# Altium project TFG.PrjPCB
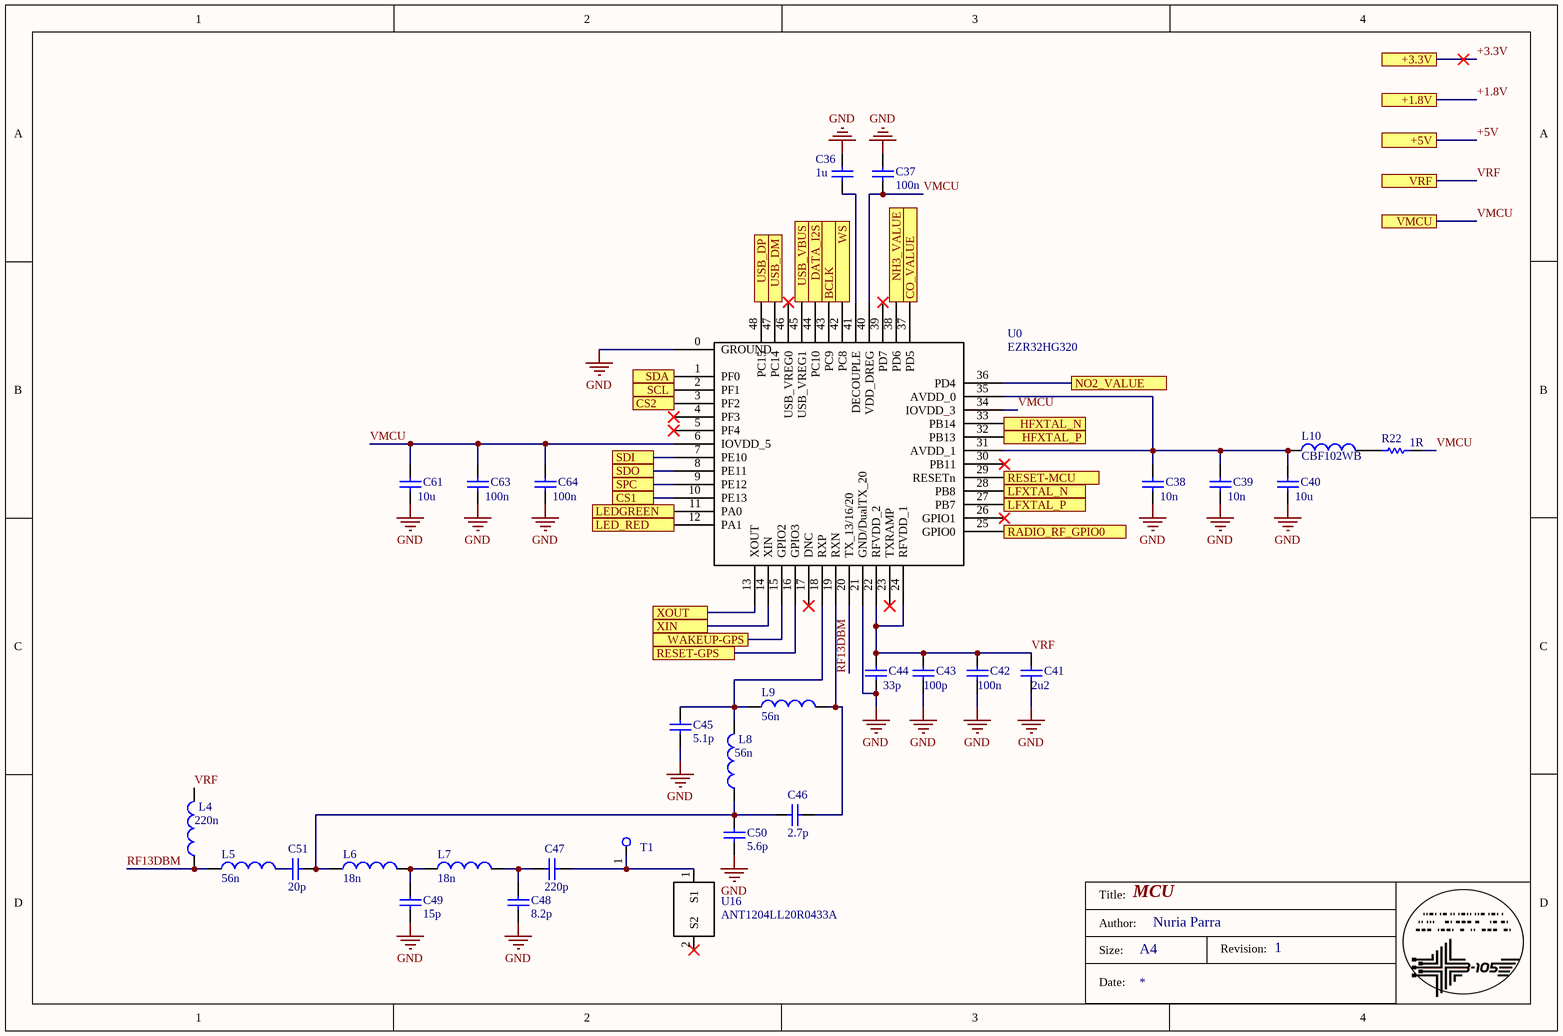
[diagram p0: MCU.SchDoc]
5 sheets, 122 parts. Net scope: flat (ports and power ports of the same name join across sheets).
Board file: PrimeraEntrega.PcbDoc
Sheets:
  MCU.SchDoc
  Reguladores.SchDoc
  VARIOS.SchDoc
  GPS.SchDoc
  SENSORES.SchDoc

## Sheet MCU.SchDoc: MCU
size A4; Engineer: Nuria Parra; Organization: Altium Limited; Address1: L3, 12a Rodborough Rd; Address2: Frenchs Forest; Address3: NSW; Address4: Australia 2086; Revision: 1

### Parts
C36  value 1u  [0603 Cap]  (hidden comment: Cap)
C37  value 100n  [0603 Cap]  (hidden comment: Cap)
C38  value 10n  [0603 Cap]  (hidden comment: Cap)
C39  value 10n  [0603 Cap]  (hidden comment: Cap)
C40  value 10u  [0603 Cap]  (hidden comment: Cap)
C41  value 2u2  [0603 Cap]  (hidden comment: Cap)
C42  value 100n  [0603 Cap]  (hidden comment: Cap)
C43  value 100p  [0603 Cap]  (hidden comment: Cap)
C44  value 33p  [0603 Cap]  (hidden comment: Cap)
C45  value 5.1p  [0603 Cap]  (hidden comment: Cap)
C46  value 2.7p  [0603 Cap]  (hidden comment: Cap)
C47  value 220p  [0603 Cap]  (hidden comment: Cap)
C48  value 8.2p  [0603 Cap]  (hidden comment: Cap)
C49  value 15p  [0603 Cap]  (hidden comment: Cap)
C50  value 5.6p  [0603 Cap]  (hidden comment: Cap)
C51  value 20p  [0603 Cap]  (hidden comment: Cap)
C61  value 10u  [0603 Cap]  (hidden comment: Cap)
C63  value 100n  [0603 Cap]  (hidden comment: Cap)
C64  value 100n  [0603 Cap]  (hidden comment: Cap)
L4  value 220n  [0603 IND]  (hidden comment: L?)
L5  value 56n  [0603 IND]  (hidden comment: L?)
L6  value 18n  [0603 IND]  (hidden comment: L?)
L7  value 18n  [0603 IND]  (hidden comment: L?)
L8  value 56n  [0603 IND]  (hidden comment: L?)
L9  value 56n  [0603 IND]  (hidden comment: L?)
L10  value CBF102WB  [0603 IND]  (hidden comment: L?)
R22  value 1R  [0603 Res]  (hidden comment: Res)
T1  testpoint  [testpoint]  (value not drawn)
U0  EZR32HG320  [EZ32HG]
U16  ANT1204LL20R0433A  [ANT1204LL20R0433A]

### Ports
+1.8V, +3.3V, +5V, BCLK, CO_VALUE, CS1, CS2, DATA_I2S, HFXTAL_N, HFXTAL_P, LED_RED, LEDGREEN, LFXTAL_N, LFXTAL_P, NH3_VALUE, NO2_VALUE, RADIO_RF_GPIO0, RESET-GPS, RESET-MCU, SCL, SDA, SDI, SDO, SPC, USB_DM, USB_DP, USB_VBUS, VMCU, VRF, WAKEUP-GPS, WS, XIN, XOUT

### Nets
GND: C36.1 C37.1 C38.1 C39.1 C40.1 C41.1 C42.1 C43.1 C44.1 C45.2 C48.2 C49.2 C50.2 C61.1 C63.1 C64.1 U0.0(GROUND) U0.21(GND/DualTX_20)
RF13DBM: L4.1 L5.1 U0.20(TX_13/16/20)
VMCU: C37.2 C61.2 C63.2 C64.2 R22.2 U0.6(IOVDD_5) U0.34(IOVDD_3) U0.40(VDD_DREG) ; port VMCU
VRF: C41.2 C42.2 C43.2 C44.2 L4.2 U0.22(RFVDD_2) U0.24(RFVDD_1) ; port VRF
NetBTN_1: U0.29(RESETn) ; port RESET-MCU
NetC24_2: U0.32(PB13) ; port HFXTAL_P
NetC26_2: U0.28(PB8) ; port LFXTAL_N
NetC27_2: U0.27(PB7) ; port LFXTAL_P
NetC35_1: U0.45(USB_VREG1) ; port USB_VBUS
NetC36_2: C36.2 U0.41(DECOUPLE)
NetC38_2: C38.2 C39.2 C40.2 L10.1 U0.31(AVDD_1) U0.35(AVDD_0)
NetC45_1: C45.1 L8.2 L9.1 U0.18(RXP)
NetC46_1: C46.1 L9.2 U0.19(RXN)
NetC46_2: C46.2 C50.1 C51.1 L6.1 L8.1
NetC47_1: C47.1 T1.1(TP) U16.1(S1)
NetC47_2: C47.2 C48.1 L7.2
NetC49_1: C49.1 L6.2 L7.1
NetC51_2: C51.2 L5.2
NetL10_2: L10.2 R22.1
NetR1_2: U0.44(PC10) ; port DATA_I2S
NetR2_1: U0.42(PC8) ; port WS
NetR3_1: U0.43(PC9) ; port BCLK
NetR4_2: U0.2(PF1) ; port SCL
NetR5_2: U0.1(PF0) ; port SDA
NetR14_2: U0.33(PB14) ; port HFXTAL_N
NetR15_1: U0.25(GPIO0) ; port RADIO_RF_GPIO0
NetR16_2: U0.11(PA0) ; port LEDGREEN
NetR17_2: U0.12(PA1) ; port LED_RED
NetR20_1: U0.47(PC14) ; port USB_DM
NetR21_1: U0.48(PC15) ; port USB_DP
NetU0_3: U0.3(PF2) ; port CS2
NetU0_7: U0.7(PE10) ; port SDI
NetU0_8: U0.8(PE11) ; port SDO
NetU0_9: U0.9(PE12) ; port SPC
NetU0_10: U0.10(PE13) ; port CS1
NetU0_13: U0.13(XOUT) ; port XOUT
NetU0_14: U0.14(XIN) ; port XIN
NetU0_15: U0.15(GPIO2) ; port WAKEUP-GPS
NetU0_16: U0.16(GPIO3) ; port RESET-GPS
NetU0_36: U0.36(PD4) ; port NO2_VALUE
NetU0_37: U0.37(PD5) ; port CO_VALUE
NetU0_38: U0.38(PD6) ; port NH3_VALUE

Not connected (* = marked no-connect by the designer): U0 4(PF3)* 5(PF4)* 17(DNC)* 23(TXRAMP)* 26(GPIO1)* 30(PB11)* 39(PD7)* 46(USB_VREG0)*; U16 2(S2)*

### Notes on the sheet
- Title:
- Size:
- Author:
- Date:
- A4
- Revision:

### Library data of the parts
L4-L10 = Ind

## Sheet Reguladores.SchDoc: Reguladores voltaje
size A4; Engineer: Nuria Parra; Organization: Altium Limited; Address1: L3, 12a Rodborough Rd; Address2: Frenchs Forest; Address3: NSW; Address4: Australia 2086; Revision: 1
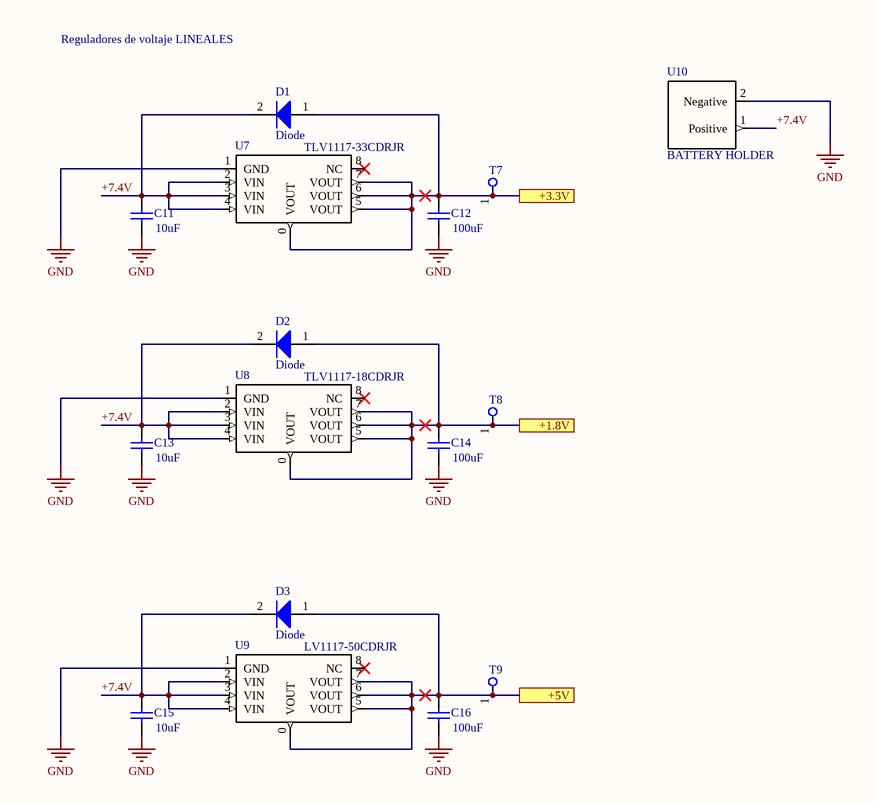
[diagram p1: Reguladores.SchDoc]

### Parts
C11  value 10uF  [0603 Cap]  (hidden comment: Cap)
C12  value 100uF  [3216 Tantalum]  (hidden comment: Cap)
C13  value 10uF  [0603 Cap]  (hidden comment: Cap)
C14  value 100uF  [3216 Tantalum]  (hidden comment: Cap)
C15  value 10uF  [0603 Cap]  (hidden comment: Cap)
C16  value 100uF  [3216 Tantalum]  (hidden comment: Cap)
D1  Diode  [SOD-123]
D2  Diode  [SOD-123]
D3  Diode  [SOD-123]
T7  testpoint  [testpoint]  (value not drawn)
T8  testpoint  [testpoint]  (value not drawn)
T9  testpoint  [testpoint]  (value not drawn)
U7  TLV1117-33CDRJR  [TLV1117]
U8  TLV1117-18CDRJR  [TLV1117]
U9  LV1117-50CDRJR  [TLV1117]
U10  BATTERY HOLDER  [battery holder 224]

### Ports
+1.8V, +3.3V, +5V

### Nets
GND: C11.1 C12.1 C13.1 C14.1 C15.1 C16.1 U7.1(GND) U8.1(GND) U9.1(GND) U10.2(Negative)
+1.8V: C14.2 D2.1(A) T8.1(TP) U8.0(VOUT) U8.5(VOUT) U8.6(VOUT) U8.7(VOUT) ; port +1.8V
+3.3V: C12.2 D1.1(A) T7.1(TP) U7.0(VOUT) U7.5(VOUT) U7.6(VOUT) U7.7(VOUT) ; port +3.3V
+5V: C16.2 D3.1(A) T9.1(TP) U9.0(VOUT) U9.5(VOUT) U9.6(VOUT) U9.7(VOUT) ; port +5V
+7.4V: C11.2 C13.2 C15.2 D1.2(C) D2.2(C) D3.2(C) U7.2(VIN) U7.3(VIN) U7.4(VIN) U8.2(VIN) U8.3(VIN) U8.4(VIN) U9.2(VIN) U9.3(VIN) U9.4(VIN) U10.1(Positive)

Not connected (* = marked no-connect by the designer): U7 8(NC)*; U8 8(NC)*; U9 8(NC)*

### Notes on the sheet
- Reguladores lineales. Condensadores de 1uF Ceramic 10V, X5R, size 0402. Enable a nivel alto
- Reguladores de voltaje LINEALES
- Title:
- Size:
- Author:
- Date:
- A4
- Revision:

### Library data of the parts
U7-U9 = TLV1117

## Sheet VARIOS.SchDoc: Varios
size A4; Engineer: Nuria Parra; Organization: Altium Limited; Address1: L3, 12a Rodborough Rd; Address2: Frenchs Forest; Address3: NSW; Address4: Australia 2086; Revision: 1
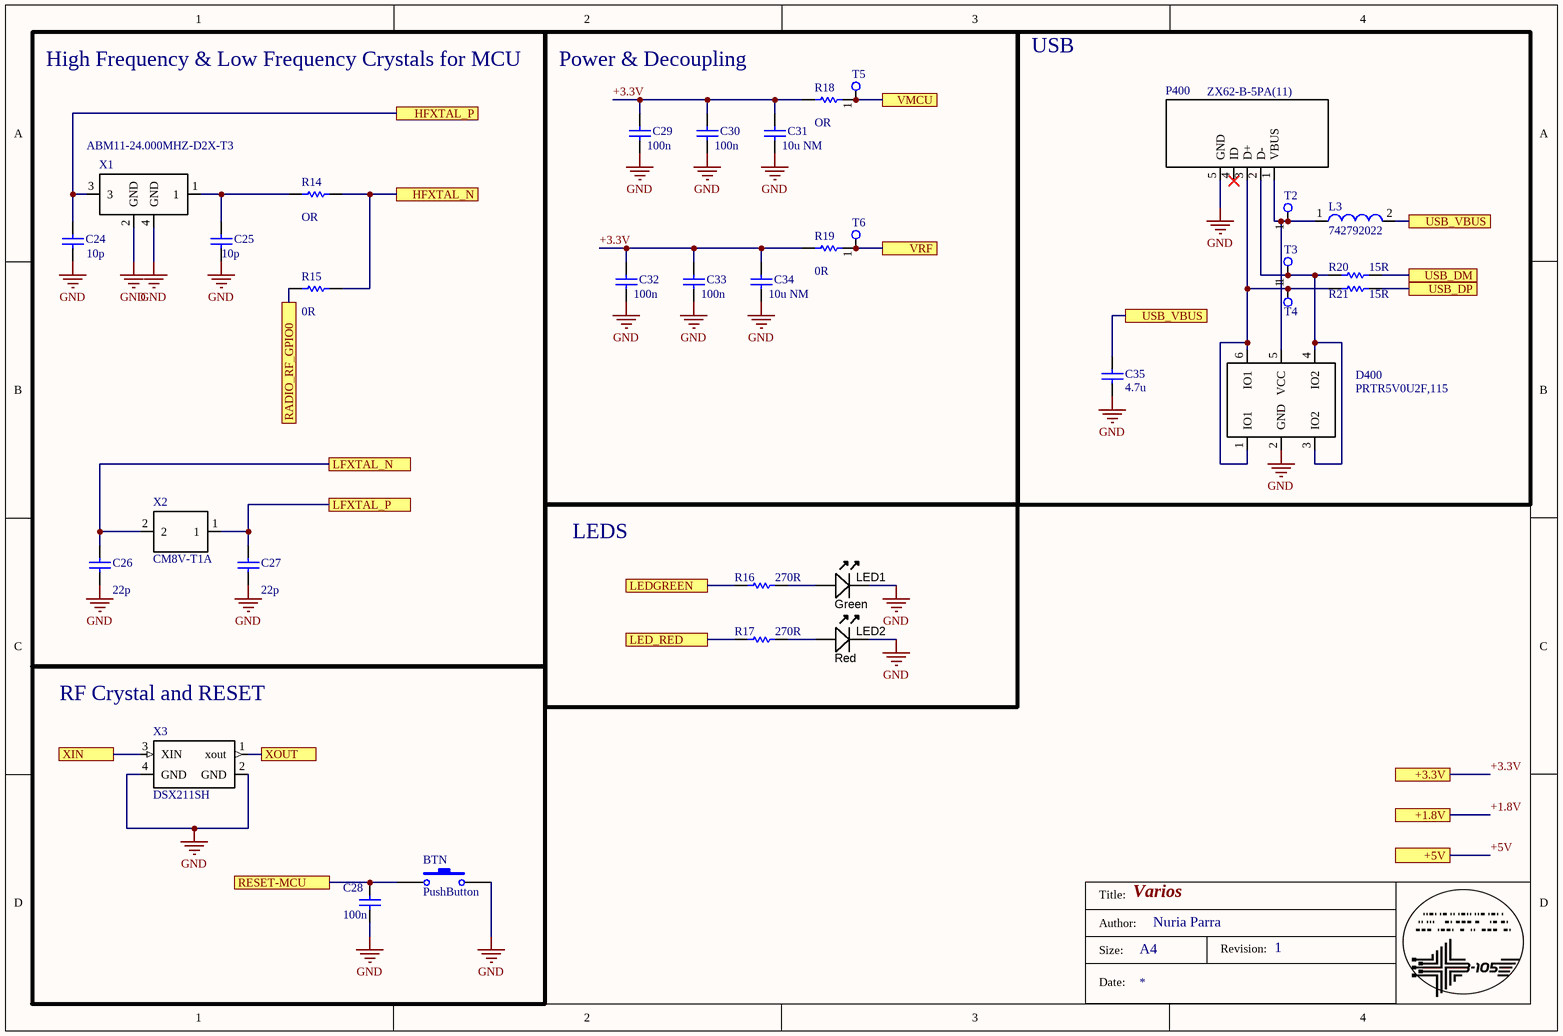
[diagram p2: VARIOS.SchDoc]

### Parts
BTN  PushButton  [Push button SMD 2 leads]
C24  value 10p  [0603 Cap]  (hidden comment: Cap)
C25  value 10p  [0603 Cap]  (hidden comment: Cap)
C26  value 22p  [0603 Cap]  (hidden comment: Cap)
C27  value 22p  [0603 Cap]  (hidden comment: Cap)
C28  value 100n  [0603 Cap]  (hidden comment: Cap)
C29  value 100n  [0603 Cap]  (hidden comment: Cap)
C30  value 100n  [0603 Cap]  (hidden comment: Cap)
C31  value 10u NM  [0603 Cap]  (hidden comment: Cap)
C32  value 100n  [0603 Cap]  (hidden comment: Cap)
C33  value 100n  [0603 Cap]  (hidden comment: Cap)
C34  value 10u NM  [0603 Cap]  (hidden comment: Cap)
C35  value 4.7u  [0603 Cap]  (hidden comment: Cap)
D400  PRTR5V0U2F,115  [PRTR5V0U2F,115]
L3  742792022  [ferritel3]
LED1  Green  [LED-0603-RED]
LED2  Red  [LED-0603-RED]
P400  ZX62-B-5PA(11)  [ZX62-B-5PA(11)]
R14  value OR  [0603 Res]  (hidden comment: Res)
R15  value 0R  [0603 Res]  (hidden comment: Res)
R16  value 270R  [0603 Res]  (hidden comment: Res)
R17  value 270R  [0603 Res]  (hidden comment: Res)
R18  value OR  [0603 Res]  (hidden comment: Res)
R19  value 0R  [0603 Res]  (hidden comment: Res)
R20  value 15R  [0603 Res]  (hidden comment: Res)
R21  value 15R  [0603 Res]  (hidden comment: Res)
T2  testpoint  [testpoint]  (value not drawn)
T3  testpoint  [testpoint]  (value not drawn)
T4  testpoint  [testpoint]  (value not drawn)
T5  testpoint  [testpoint]  (value not drawn)
T6  testpoint  [testpoint]  (value not drawn)
X1  ABM11-24.000MHZ-D2X-T3  [abm]
X2  CM8V-T1A  [CM8V-T1A]
X3  DSX211SH  [DSX211SH]

### Blocks framed on the sheet
High Frequency & Low Frequency Crystals for MCU: C24-C27 R14 R15 X1 X2
Power & Decoupling: C29-C34 R18 R19 T5 T6
USB: C35 D400 L3 P400 R20 R21 T2-T4
LEDS: LED1 LED2 R16 R17
RF Crystal and RESET: BTN C28 X3

### Ports
+1.8V, +3.3V, +5V, HFXTAL_N, HFXTAL_P, LED_RED, LEDGREEN, LFXTAL_N, LFXTAL_P, RADIO_RF_GPIO0, RESET-MCU, USB_DM, USB_DP, USB_VBUS, VMCU, VRF, XIN, XOUT

### Nets
GND: BTN.2 C24.1 C25.1 C26.1 C27.1 C28.1 C29.1 C30.1 C31.1 C32.1 C33.1 C34.1 C35.2 D400.2(GND) LED1.K LED2.K P400.5(GND) X1.2(GND) X1.4(GND) X3.2(GND) X3.4(GND)
+3.3V: C29.2 C30.2 C31.2 C32.2 C33.2 C34.2 R18.1 R19.1 ; port +3.3V
VMCU: R18.2 T5.1(TP) ; port VMCU
VRF: R19.2 T6.1(TP) ; port VRF
NetBTN_1: BTN.1 C28.2 ; port RESET-MCU
NetC24_2: C24.2 X1.3 ; port HFXTAL_P
NetC25_2: C25.2 R14.1 X1.1
NetC26_2: C26.2 X2.2 ; port LFXTAL_N
NetC27_2: C27.2 X2.1 ; port LFXTAL_P
NetC35_1: C35.1 L3.2 ; port USB_VBUS
NetD400_1: D400.1(IO1) D400.6(IO1) P400.3(D+) R21.2 T4.1(TP)
NetD400_3: D400.3(IO2) D400.4(IO2) P400.2(D-) R20.2 T3.1(TP)
NetD400_5: D400.5(VCC) L3.1 P400.1(VBUS) T2.1(TP)
NetLED1_A: LED1.A R16.1
NetLED2_A: LED2.A R17.1
NetR14_2: R14.2 R15.2 ; port HFXTAL_N
NetR15_1: R15.1 ; port RADIO_RF_GPIO0
NetR16_2: R16.2 ; port LEDGREEN
NetR17_2: R17.2 ; port LED_RED
NetR20_1: R20.1 ; port USB_DM
NetR21_1: R21.1 ; port USB_DP
NetU0_13: X3.1(xout) ; port XOUT
NetU0_14: X3.3(XIN) ; port XIN

Not connected (* = marked no-connect by the designer): P400 4(ID)*

### Notes on the sheet
- Title:
- Size:
- Author:
- Date:
- A4
- Revision:

### Library data of the parts
LED1 = LED_SMD_Green_0603_570nm: LED 0603 SMD Green 570nm 50mcd 20mA; Manufacturer 1: Kingbright Company LLC; Manufacturer Part Number 1: APT1608CGCK; Material: AlGaInP; Ratings: 20mcd min; 50 mcd typ; 570 nm; Voltage - Forward (Vf) Typ: 2.1V; Viewing Angle: 120°; Lens Style/Size: Rectangle with Flat Top, 1.1mm x 0.8mm; Voltage - Forward (Vf) @ 10mA: 2.0V; SCDType: source; Wavelength - Peak: 574nm; Lens Type: Clear; Package / Case: 0603 (1608 metric); Color: Green; Current - Test: 20mA; Supplier 1: Digi-Key; Supplier Part Number 1: 754-1116-1-ND; RoHS 1: RoHS Compliant; Wavelength - Dominant: 570nm; ComponentLink1Description: DataSheet; ComponentLink1URL: http://www.us.kingbright.com/images/catalog/SPEC/APT1608CGCK.pdf
LED2 = LED_SMD_Red_0603_220mcd: LED 0603 SMD Hyper Red 630nm 220mcd 20mA; Manufacturer 1: Kingbright Company LLC; Manufacturer Part Number 1: APT1608SURCK; Material: AlGaInP on GaAs; Ratings: 220 mcd; 630 nm; Voltage - Forward (Vf) Typ: 1.95V; Voltage - Forward (Vf) @ 10mA: 1.9V; SCDType: source; Package / Case: 0603 (1608 metric); Supplier 1: Digi-Key; Supplier Part Number 1: 754-1123-1-ND; ComponentLink1Description: DataSheet; ComponentLink1URL: http://www.us.kingbright.com/images/catalog/SPEC/APT1608CGCK.pdf

## Sheet GPS.SchDoc: Módulo GPS
size A4; Engineer: Nuria Parra; Revision: 1
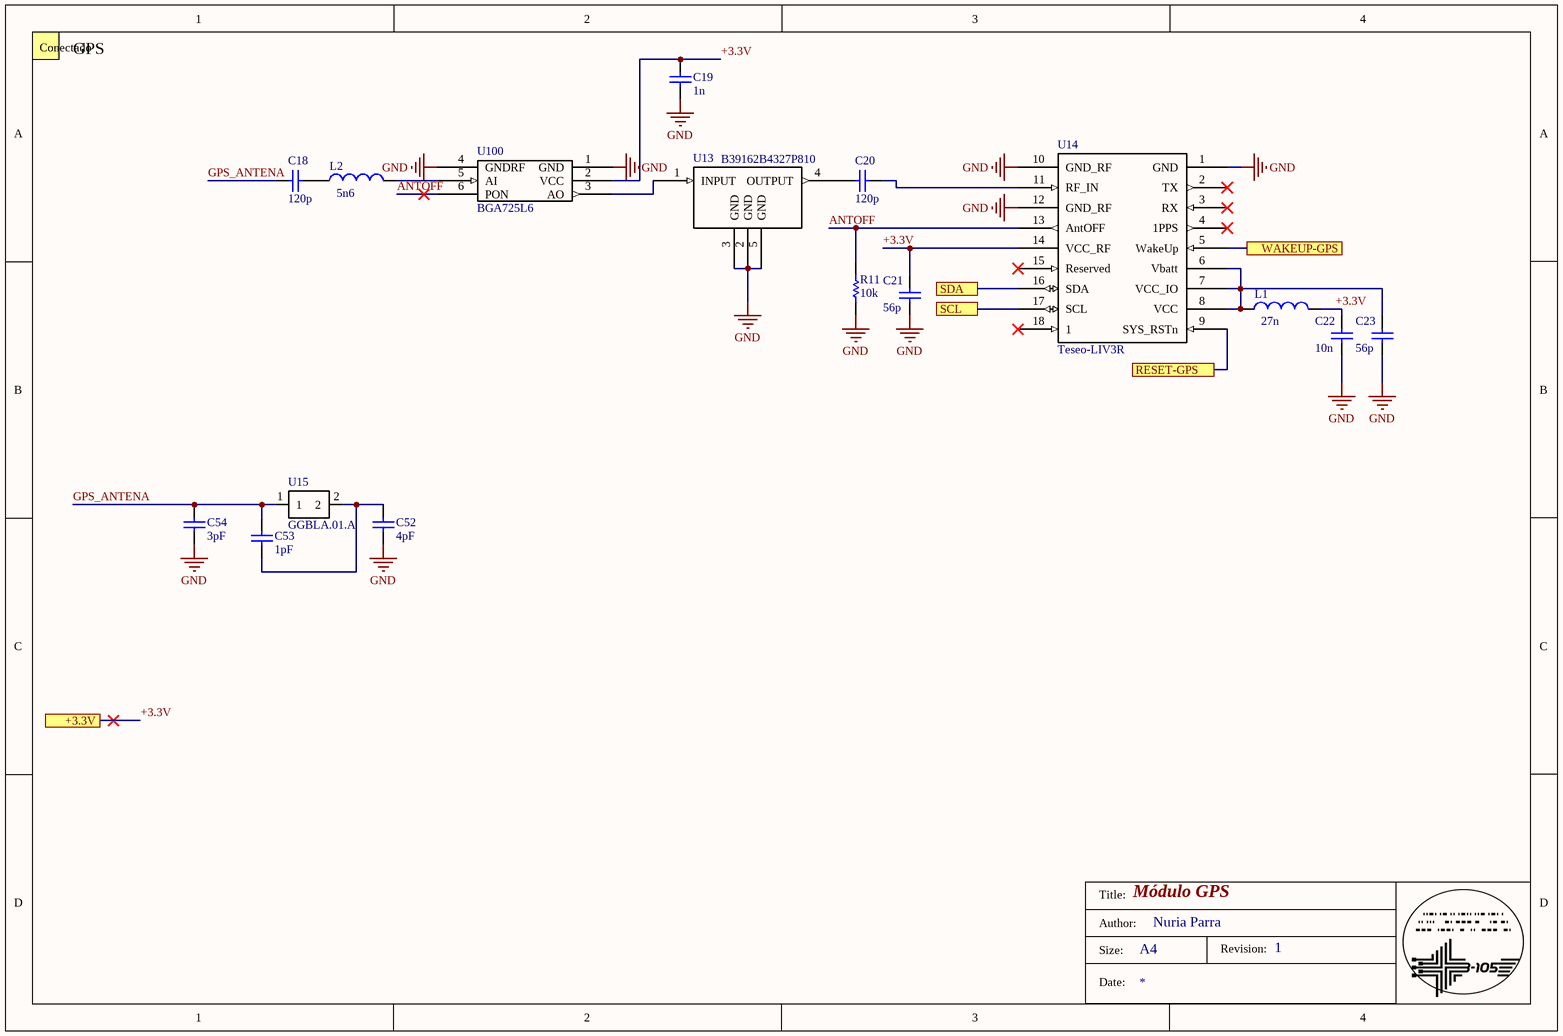
[diagram p3: GPS.SchDoc]

### Parts
C18  value 120p  [0402 CAP]  (hidden comment: Cap)
C19  value 1n  [0402 CAP]  (hidden comment: Cap)
C20  value 120p  [0402 CAP]  (hidden comment: Cap)
C21  value 56p  [0201 CAP]  (hidden comment: Cap)
C22  value 10n  [0201 CAP]  (hidden comment: Cap)
C23  value 56p  [0201 CAP]  (hidden comment: Cap)
C52  value 4pF  [0402 CAP]  (hidden comment: Cap)
C53  value 1pF  [0402 CAP]  (hidden comment: Cap)
C54  value 3pF  [0402 CAP]  (hidden comment: Cap)
L1  value 27n  [0402 IND]  (hidden comment: L?)
L2  value 5n6  [0402 IND]  (hidden comment: L?)
R11  10k  [0402 RES]
U13  B39162B4327P810  [B39162B4327P810]
U14  Teseo-LIV3R  [GPS]
U15  GGBLA.01.A  [GGBLA.01.A]
U100  BGA725L6  [BGA]

### Ports
+3.3V, RESET-GPS, SCL, SDA, WAKEUP-GPS

### Nets
GND: C19.2 C21.1 C22.1 C23.1 C52.2 C54.2 R11.1 U13.2(GND) U13.3(GND) U13.5(GND) U14.1(GND) U14.10(GND_RF) U14.12(GND_RF) U100.1(GND) U100.4(GNDRF)
+3.3V: C19.1 C21.2 C22.2 L1.2 U14.14(VCC_RF) U100.2(VCC) ; port +3.3V
ANTOFF: R11.2 U14.13(AntOFF) U100.6(PON)
GPS_ANTENA: C18.2 C53.1 C54.1 U15.1
NetC18_1: C18.1 L2.1
NetC20_1: C20.1 U13.4(OUTPUT)
NetC20_2: C20.2 U14.11(RF_IN)
NetC23_2: C23.2 L1.1 U14.6(Vbatt) U14.7(VCC_IO) U14.8(VCC)
NetC52_1: C52.1 C53.2 U15.2
NetL2_2: L2.2 U100.5(AI)
NetR4_2: U14.17(SCL) ; port SCL
NetR5_2: U14.16(SDA) ; port SDA
NetU0_15: U14.5(WakeUp) ; port WAKEUP-GPS
NetU0_16: U14.9(SYS_RSTn) ; port RESET-GPS
NetU13_1: U13.1(INPUT) U100.3(AO)

Not connected (* = marked no-connect by the designer): U14 2(TX)* 3(RX)* 4(1PPS)* 15(Reserved)* 18(1)*

### Notes on the sheet
- Conectado por I2C
- GPS
- Title:
- Size:
- Author:
- Date:
- A4
- Revision:

### Library data of the parts
L1 L2 = Ind
R11 = Res: Value: 1K
U14 = GPS

## Sheet SENSORES.SchDoc: Sensores
size A4; Engineer: Nuria Parra; Revision: 1
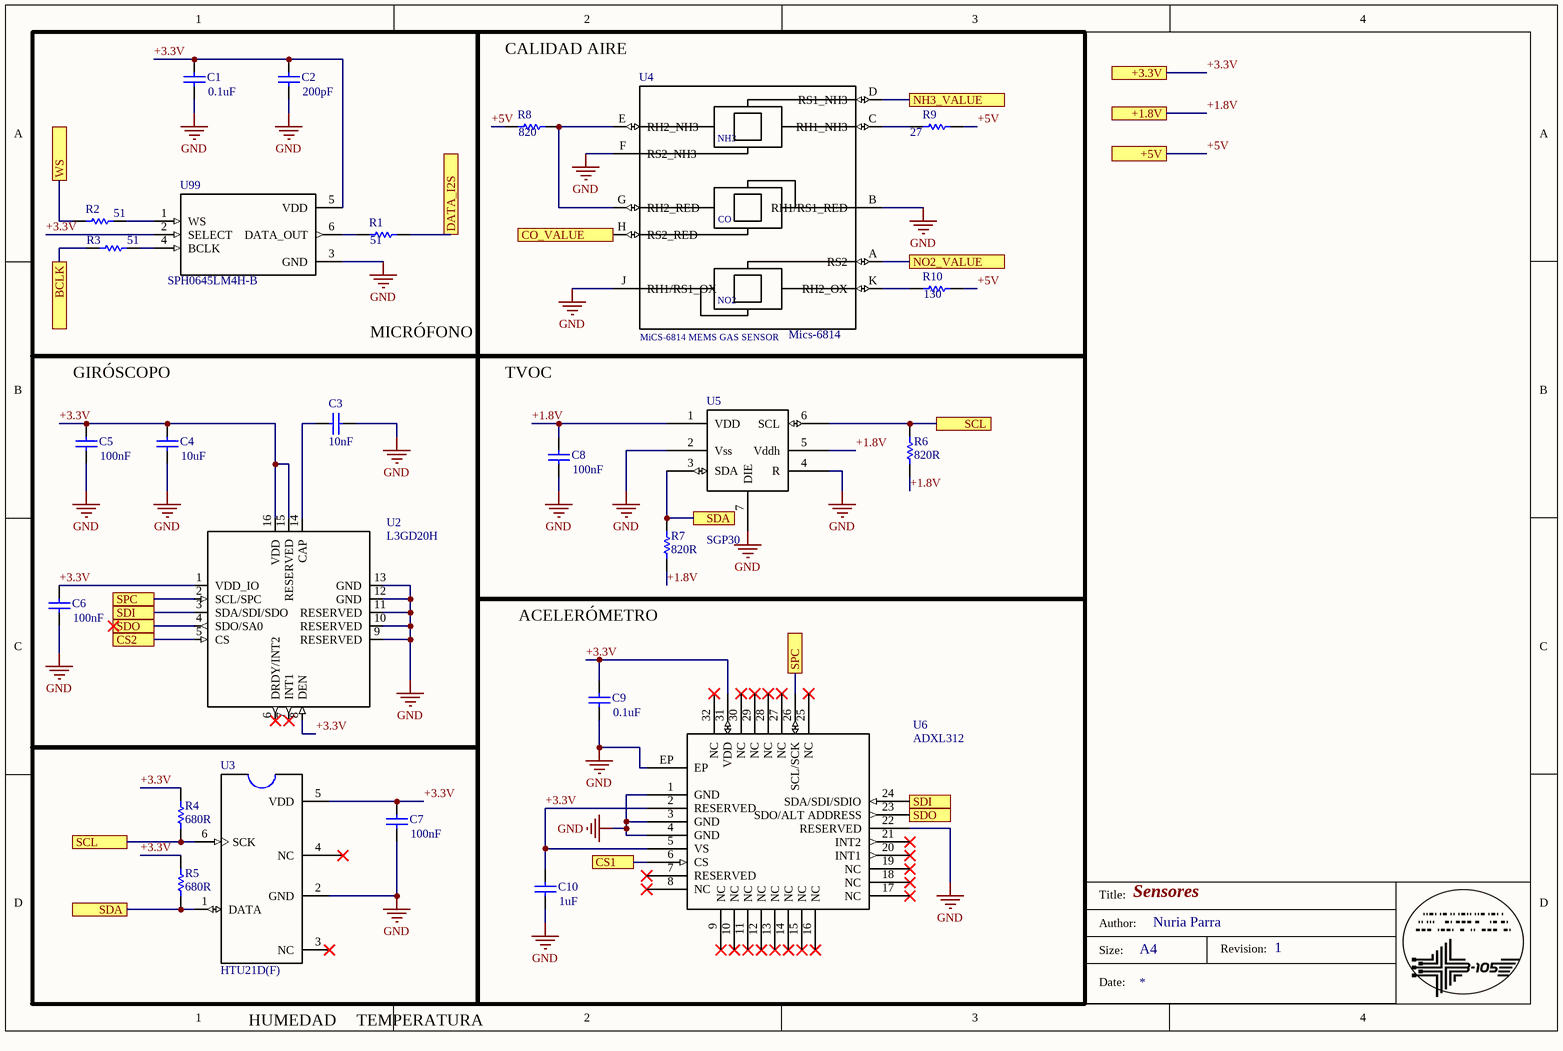
[diagram p4: SENSORES.SchDoc]

### Parts
C1  value 0.1uF  [0603 Cap]  (hidden comment: Cap)
C2  value 200pF  [0603 Cap]  (hidden comment: Cap)
C3  value 10nF  [0603 Cap]  (hidden comment: Cap)
C4  value 10uF  [0603 Cap]  (hidden comment: Cap)
C5  value 100nF  [0603 Cap]  (hidden comment: Cap)
C6  value 100nF  [0603 Cap]  (hidden comment: Cap)
C7  value 100nF  [0603 Cap]  (hidden comment: Cap)
C8  value 100nF  [0603 Cap]  (hidden comment: Cap)
C9  value 0.1uF  [0603 Cap]  (hidden comment: Cap)
C10  value 1uF  [0603 Cap]  (hidden comment: Cap)
R1  51  [0603 Res]
R2  51  [0603 Res]
R3  51  [0603 Res]
R4  value 680R  [0603 Res]  (hidden comment: 27)
R5  value 680R  [0603 Res]  (hidden comment: 27)
R6  value 820R  [0603 Res]  (hidden comment: 27)
R7  value 820R  [0603 Res]  (hidden comment: 27)
R8  value 820  [0603 Res]  (hidden comment: 51)
R9  27  [0603 Res]
R10  130  [0603 Res]
U2  L3GD20H  [Giroscopo]
U3  HTU21D(F)  [TempeYHumedad]
U4  Mics-6814  [mics6814]
U5  SGP30  [sgp30]
U6  ADXL312  [Acelerometro]
U99  SPH0645LM4H-B  [microfono]

### Blocks framed on the sheet
MICRÓFONO: C1 C2 R1-R3 U99
CALIDAD AIRE: R8-R10 U4
GIRÓSCOPO: C3-C6 U2
TVOC: C8 R6 R7 U5
ACELERÓMETRO: C9 C10 U6

### Ports
+1.8V, +3.3V, +5V, BCLK, CO_VALUE, CS1, CS2, DATA_I2S, NH3_VALUE, NO2_VALUE, SCL, SDA, SDI, SDO, SPC, WS

### Nets
GND: C1.1 C2.1 C3.1 C4.1 C5.1 C6.1 C7.1 C8.1 C9.1 C10.1 U2.9(RESERVED) U2.10(RESERVED) U2.11(RESERVED) U2.12(GND) U2.13(GND) U3.2(GND) U4.B(RH1/RS1_RED) U4.F(RS2_NH3) U4.J(RH1/RS1_OX) U5.2(Vss) U5.4(R) U5.7(DIE) U6.1(GND) U6.3(GND) U6.4(GND) U6.22(RESERVED) U6.EP U99.3(GND)
+1.8V: C8.2 R6.1 R7.1 U5.1(VDD) U5.5(Vddh) ; port +1.8V
+3.3V: C1.2 C2.2 C4.2 C5.2 C6.2 C7.2 C9.2 C10.2 R4.1 R5.1 U2.1(VDD_IO) U2.8(DEN) U2.15(RESERVED) U2.16(VDD) U3.5(VDD) U6.2(RESERVED) U6.5(VS) U6.31(VDD) U99.2(SELECT) U99.5(VDD) ; port +3.3V
+5V: R8.1 R9.2 R10.2 ; port +5V
NetC3_2: C3.2 U2.14(CAP)
NetR1_1: R1.1 U99.6(DATA_OUT)
NetR1_2: R1.2 ; port DATA_I2S
NetR2_1: R2.1 ; port WS
NetR2_2: R2.2 U99.1(WS)
NetR3_1: R3.1 ; port BCLK
NetR3_2: R3.2 U99.4(BCLK)
NetR4_2: R4.2 R6.2 U3.6(SCK) U5.6(SCL) ; port SCL
NetR5_2: R5.2 R7.2 U3.1(DATA) U5.3(SDA) ; port SDA
NetR8_2: R8.2 U4.E(RH2_NH3) U4.G(RH2_RED)
NetR9_1: R9.1 U4.C(RH1_NH3)
NetR10_1: R10.1 U4.K(RH2_OX)
NetU0_3: U2.5(CS) ; port CS2
NetU0_7: U2.3(SDA/SDI/SDO) U6.24(SDA/SDI/SDIO) ; port SDI
NetU0_8: U2.4(SDO/SA0) U6.23(SDO/ALT_ADDRESS) ; port SDO
NetU0_9: U2.2(SCL/SPC) U6.26(SCL/SCK) ; port SPC
NetU0_10: U6.6(CS) ; port CS1
NetU0_36: U4.A(RS2) ; port NO2_VALUE
NetU0_37: U4.H(RS2_RED) ; port CO_VALUE
NetU0_38: U4.D(RS1_NH3) ; port NH3_VALUE

Not connected (* = marked no-connect by the designer): U2 6(DRDY/INT2)* 7(INT1)*; U3 3(NC)* 4(NC)*; U6 7(RESERVED)* 8(NC)* 9(NC)* 10(NC)* 11(NC)* 12(NC)* 13(NC)* 14(NC)* 15(NC)* 16(NC)* 17(NC)* 18(NC)* 19(NC)* 20(INT1)* 21(INT2)* 25(NC)* 27(NC)* 28(NC)* 29(NC)* 30(NC)* 32(NC)*

### Notes on the sheet
- Conectado por I2S
- Conectado a través de ADC
- Conectado por SPI
- Conectado por I2C
- Conectado por SPI. Condensador de 1u TANTALUM y de 0.1 ceramico
- HUMEDAD
- TEMPERATURA
- Title:
- Size:
- Author:
- Date:
- A4
- Revision:
- (in symbol Mics-6814) NH3; CO; NO2; MiCS-6814 MEMS GAS SENSOR

### Library data of the parts
R1-R10 = Res
  R1-R3: Value: 51
  R9: Value: 27
  R10: Value: 130
U2 = Giroscopo
U3 = TemperaturaHumedad
U6 = Acelerometro
U99 = Microfono

## Nets that join several sheets
GND: MCU (18 pins), Reguladores (10 pins), VARIOS (21 pins), GPS (15 pins), SENSORES (28 pins)
+1.8V: Reguladores (7 pins), SENSORES (5 pins)
+3.3V: Reguladores (7 pins), VARIOS (8 pins), GPS (6 pins), SENSORES (20 pins)
+5V: Reguladores (7 pins), SENSORES (R8.1 R9.2 R10.2)
NetBTN_1: MCU (U0.29), VARIOS (BTN.1 C28.2)
NetC24_2: MCU (U0.32), VARIOS (C24.2 X1.3)
NetC26_2: MCU (U0.28), VARIOS (C26.2 X2.2)
NetC27_2: MCU (U0.27), VARIOS (C27.2 X2.1)
NetC35_1: MCU (U0.45), VARIOS (C35.1 L3.2)
NetR1_2: MCU (U0.44), SENSORES (R1.2)
NetR2_1: MCU (U0.42), SENSORES (R2.1)
NetR3_1: MCU (U0.43), SENSORES (R3.1)
NetR4_2: MCU (U0.2), GPS (U14.17), SENSORES (R4.2 R6.2 U3.6 U5.6)
NetR5_2: MCU (U0.1), GPS (U14.16), SENSORES (R5.2 R7.2 U3.1 U5.3)
NetR14_2: MCU (U0.33), VARIOS (R14.2 R15.2)
NetR15_1: MCU (U0.25), VARIOS (R15.1)
NetR16_2: MCU (U0.11), VARIOS (R16.2)
NetR17_2: MCU (U0.12), VARIOS (R17.2)
NetR20_1: MCU (U0.47), VARIOS (R20.1)
NetR21_1: MCU (U0.48), VARIOS (R21.1)
NetU0_3: MCU (U0.3), SENSORES (U2.5)
NetU0_7: MCU (U0.7), SENSORES (U2.3 U6.24)
NetU0_8: MCU (U0.8), SENSORES (U2.4 U6.23)
NetU0_9: MCU (U0.9), SENSORES (U2.2 U6.26)
NetU0_10: MCU (U0.10), SENSORES (U6.6)
NetU0_13: MCU (U0.13), VARIOS (X3.1)
NetU0_14: MCU (U0.14), VARIOS (X3.3)
NetU0_15: MCU (U0.15), GPS (U14.5)
NetU0_16: MCU (U0.16), GPS (U14.9)
NetU0_36: MCU (U0.36), SENSORES (U4.A)
NetU0_37: MCU (U0.37), SENSORES (U4.H)
NetU0_38: MCU (U0.38), SENSORES (U4.D)
VMCU: MCU (8 pins), VARIOS (R18.2 T5.1)
VRF: MCU (7 pins), VARIOS (R19.2 T6.1)